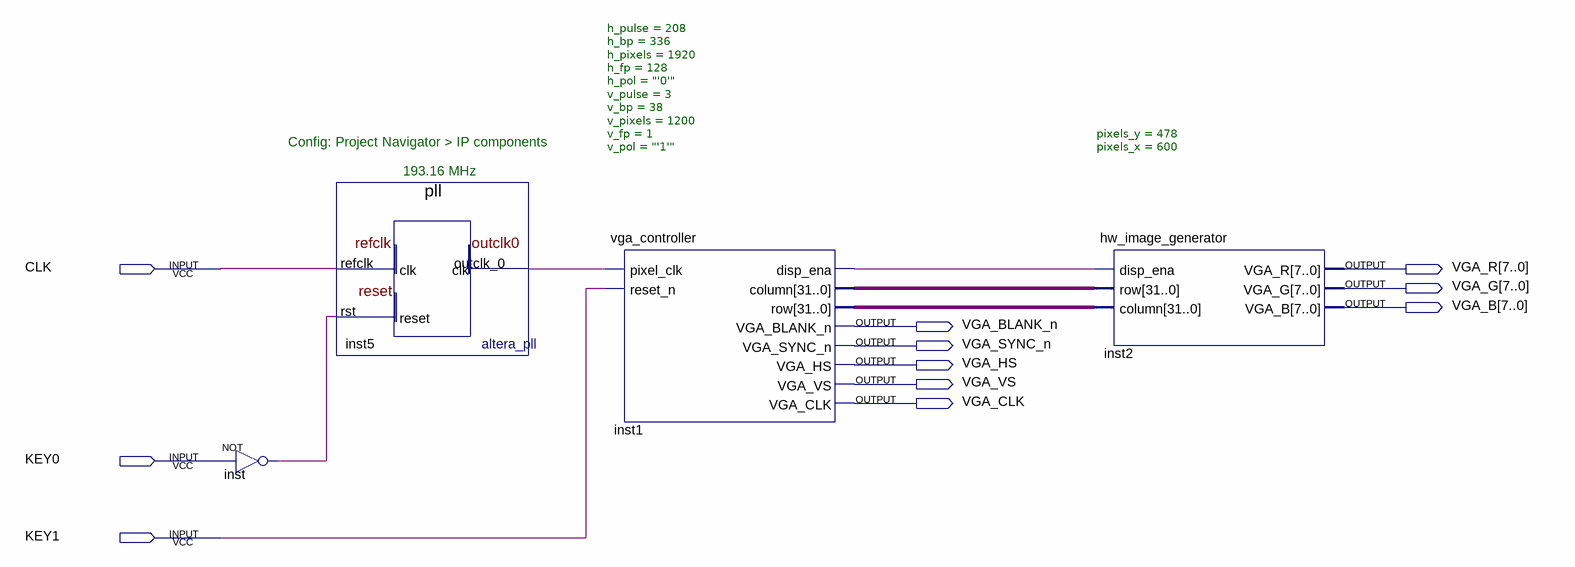
[diagram p0: schematic sheet]
// Quartus schematic main.bdf as structural Verilog: 4 symbols, 11 pins
module main (
  input  CLK,
  input  KEY0,
  input  KEY1,
  output [7:0] VGA_R,
  output [7:0] VGA_G,
  output [7:0] VGA_B,
  output VGA_BLANK_n,
  output VGA_SYNC_n,
  output VGA_HS,
  output VGA_VS,
  output VGA_CLK
);

  wire inst1_disp_ena, inst5_outclk_0, inst_out;
  wire [31:0] inst1_column, inst1_row;

  not inst (inst_out, KEY0);
  pll inst5 (.refclk(CLK), .rst(inst_out), .outclk_0(inst5_outclk_0));
  vga_controller #(.h_pulse(208), .h_bp(336), .h_pixels(1920), .h_fp(128), .h_pol("'0'"), .v_pulse(3), .v_bp(38), .v_pixels(1200), .v_fp(1), .v_pol("'1'")) inst1 (
    .pixel_clk(inst5_outclk_0), .reset_n(KEY1), .disp_ena(inst1_disp_ena), .column(inst1_column),
    .row(inst1_row), .VGA_BLANK_n(VGA_BLANK_n), .VGA_SYNC_n(VGA_SYNC_n), .VGA_HS(VGA_HS), .VGA_VS(VGA_VS),
    .VGA_CLK(VGA_CLK));
  hw_image_generator #(.pixels_y(478), .pixels_x(600)) inst2 (
    .disp_ena(inst1_disp_ena), .row(inst1_column), .column(inst1_row), .VGA_R(VGA_R), .VGA_G(VGA_G),
    .VGA_B(VGA_B));

  // Notes on the sheet:
  //   Config: Project Navigator > IP components 
  //   193.16 MHz 
endmodule
